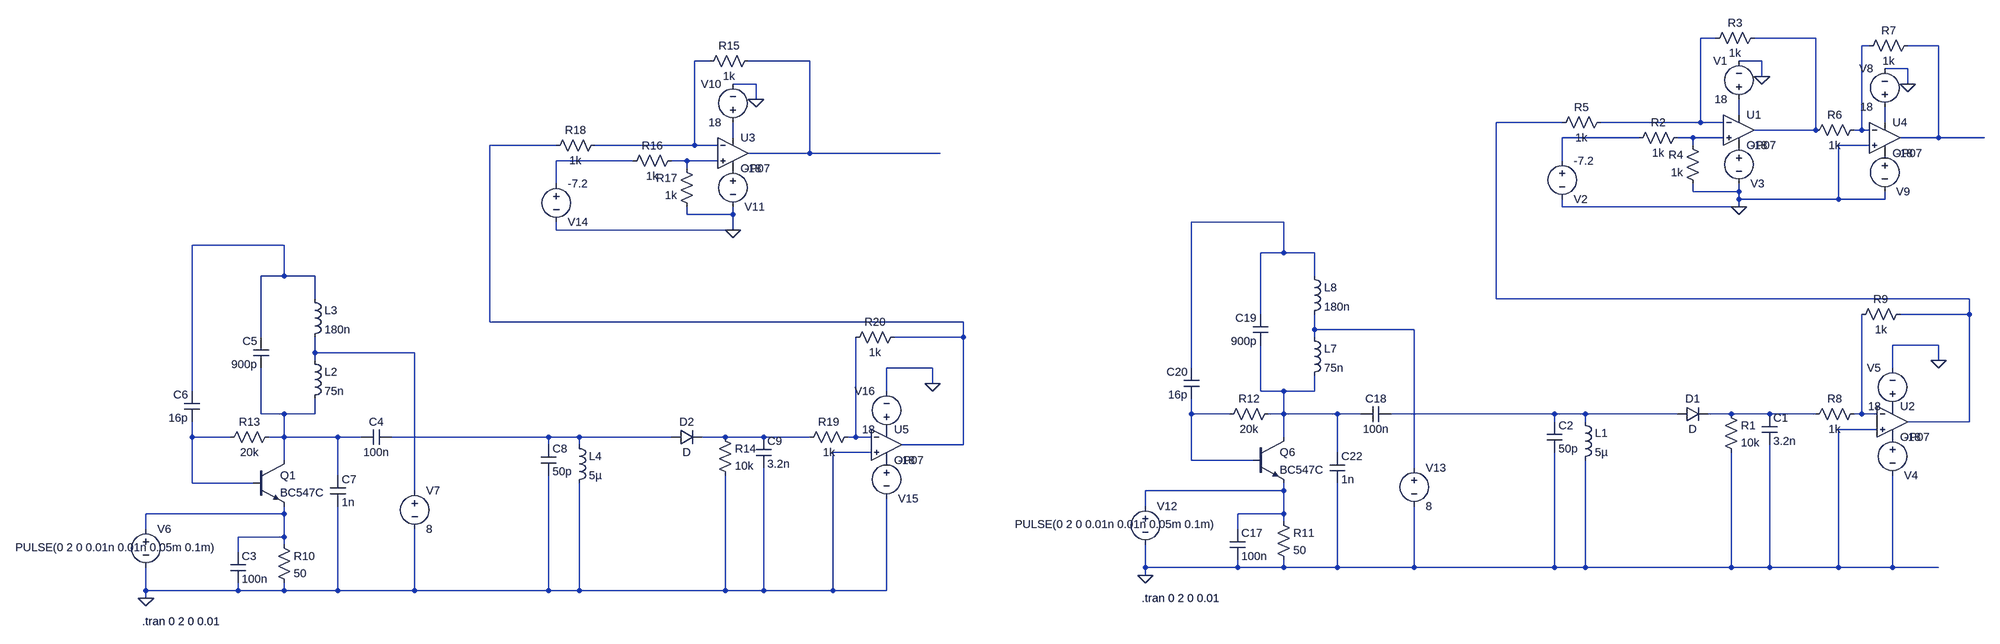
[diagram p0: schematic Empfaenger_Sender_Subtrahierer_Methode01.asc]
Empfaenger_Sender_Subtrahierer_Methode01.asc, the LTspice schematic file:
Version 4
SHEET 1 5860 1152
WIRE 1616 -80 1584 -80
WIRE 1824 -80 1696 -80
WIRE 1936 -64 1920 -64
WIRE 2080 -64 2016 -64
WIRE -1648 -32 -1680 -32
WIRE -1440 -32 -1568 -32
WIRE 1712 -32 1664 -32
WIRE 2016 -16 1968 -16
WIRE 1712 0 1712 -32
WIRE -1552 16 -1600 16
WIRE 2016 16 2016 -16
WIRE -1552 48 -1552 16
WIRE 1664 80 1664 48
WIRE 1296 96 1152 96
WIRE 1584 96 1584 -80
WIRE 1584 96 1376 96
WIRE 1632 96 1584 96
WIRE 1968 96 1968 64
WIRE 1824 112 1824 -80
WIRE 1824 112 1696 112
WIRE 1920 112 1920 -64
WIRE 1920 112 1904 112
WIRE 1936 112 1920 112
WIRE -1600 128 -1600 96
WIRE 1456 128 1296 128
WIRE 1568 128 1536 128
WIRE 1632 128 1568 128
WIRE 2080 128 2080 -64
WIRE 2080 128 2000 128
WIRE 2176 128 2080 128
WIRE -1968 144 -2112 144
WIRE -1680 144 -1680 -32
WIRE -1680 144 -1888 144
WIRE -1632 144 -1680 144
WIRE 1568 144 1568 128
WIRE 1936 144 1872 144
WIRE -1440 160 -1440 -32
WIRE -1440 160 -1568 160
WIRE -1168 160 -1440 160
WIRE -1808 176 -1968 176
WIRE -1696 176 -1728 176
WIRE -1632 176 -1696 176
WIRE 1296 176 1296 128
WIRE -1696 192 -1696 176
WIRE -1968 224 -1968 176
WIRE 1568 240 1568 224
WIRE 1664 240 1664 224
WIRE 1664 240 1568 240
WIRE 1664 256 1664 240
WIRE 1872 256 1872 144
WIRE 1872 256 1664 256
WIRE 1968 256 1968 240
WIRE 1968 256 1872 256
WIRE 1296 272 1296 256
WIRE 1664 272 1664 256
WIRE 1664 272 1296 272
WIRE -1696 288 -1696 272
WIRE -1600 288 -1600 272
WIRE -1600 288 -1696 288
WIRE 544 304 352 304
WIRE -1968 320 -1968 304
WIRE -1600 320 -1600 288
WIRE -1600 320 -1968 320
WIRE -2720 352 -2912 352
WIRE 544 368 544 304
WIRE 544 368 496 368
WIRE 608 368 544 368
WIRE -2720 416 -2720 352
WIRE -2720 416 -2768 416
WIRE -2656 416 -2720 416
WIRE 608 416 608 368
WIRE -2656 464 -2656 416
WIRE 1152 464 1152 96
WIRE 2144 464 1152 464
WIRE 496 496 496 368
WIRE 2144 496 2144 464
WIRE 2144 496 2000 496
WIRE -2112 512 -2112 144
WIRE -1120 512 -2112 512
WIRE 608 528 608 496
WIRE 816 528 608 528
WIRE -2768 544 -2768 416
WIRE -1120 544 -1120 512
WIRE -1120 544 -1264 544
WIRE 608 544 608 528
WIRE 2080 560 1984 560
WIRE -2656 576 -2656 544
WIRE -2448 576 -2656 576
WIRE -2656 592 -2656 576
WIRE 2080 592 2080 560
WIRE -1184 608 -1280 608
WIRE 352 608 352 304
WIRE 1984 608 1984 560
WIRE -1184 640 -1184 608
WIRE -2912 656 -2912 352
WIRE -1280 656 -1280 608
WIRE 496 656 496 560
WIRE 544 656 496 656
WIRE 608 656 608 624
WIRE 608 656 544 656
WIRE -2768 704 -2768 608
WIRE -2720 704 -2768 704
WIRE -2656 704 -2656 672
WIRE -2656 704 -2720 704
WIRE 352 704 352 672
WIRE 432 704 352 704
WIRE 544 704 544 656
WIRE 544 704 512 704
WIRE 656 704 544 704
WIRE 704 704 656 704
WIRE 1280 704 768 704
WIRE 1344 704 1280 704
WIRE 1536 704 1344 704
WIRE 1648 704 1600 704
WIRE 1728 704 1648 704
WIRE 1824 704 1728 704
WIRE 1920 704 1920 496
WIRE 1920 704 1904 704
WIRE 1952 704 1920 704
WIRE 1280 720 1280 704
WIRE 1344 720 1344 704
WIRE 2144 720 2144 496
WIRE 2144 720 2016 720
WIRE 1952 736 1872 736
WIRE -2912 752 -2912 720
WIRE -2832 752 -2912 752
WIRE -2720 752 -2720 704
WIRE -2720 752 -2752 752
WIRE -2608 752 -2720 752
WIRE -2560 752 -2608 752
WIRE -1984 752 -2496 752
WIRE -1920 752 -1984 752
WIRE -1728 752 -1920 752
WIRE -1616 752 -1664 752
WIRE -1536 752 -1616 752
WIRE -1440 752 -1536 752
WIRE -1344 752 -1344 544
WIRE -1344 752 -1360 752
WIRE -1312 752 -1344 752
WIRE 544 752 544 704
WIRE -1984 768 -1984 752
WIRE -1920 768 -1920 752
WIRE -1120 768 -1120 544
WIRE -1120 768 -1248 768
WIRE -1312 784 -1392 784
WIRE 656 784 656 704
WIRE -2720 800 -2720 752
WIRE 352 800 352 704
WIRE 480 800 352 800
WIRE 816 816 816 528
WIRE -2608 832 -2608 752
WIRE -2912 848 -2912 752
WIRE -2784 848 -2912 848
WIRE -2448 864 -2448 576
WIRE 544 864 544 848
WIRE 544 864 256 864
WIRE 256 896 256 864
WIRE -2720 912 -2720 896
WIRE -2720 912 -3008 912
WIRE 544 912 544 864
WIRE 544 912 448 912
WIRE 544 928 544 912
WIRE -3008 944 -3008 912
WIRE 448 944 448 912
WIRE -2720 960 -2720 912
WIRE -2720 960 -2816 960
WIRE -2720 976 -2720 960
WIRE -2816 992 -2816 960
WIRE 256 1024 256 976
WIRE 448 1024 448 1008
WIRE 448 1024 256 1024
WIRE 544 1024 544 1008
WIRE 544 1024 448 1024
WIRE 656 1024 656 848
WIRE 656 1024 544 1024
WIRE 816 1024 816 896
WIRE 816 1024 656 1024
WIRE 1280 1024 1280 784
WIRE 1280 1024 816 1024
WIRE 1344 1024 1344 800
WIRE 1344 1024 1280 1024
WIRE 1648 1024 1648 784
WIRE 1648 1024 1344 1024
WIRE 1728 1024 1728 768
WIRE 1728 1024 1648 1024
WIRE 1872 1024 1872 736
WIRE 1872 1024 1728 1024
WIRE 1984 1024 1984 832
WIRE 1984 1024 1872 1024
WIRE 2080 1024 1984 1024
WIRE 256 1040 256 1024
WIRE -3008 1072 -3008 1024
WIRE -2816 1072 -2816 1056
WIRE -2816 1072 -3008 1072
WIRE -2720 1072 -2720 1056
WIRE -2720 1072 -2816 1072
WIRE -2608 1072 -2608 896
WIRE -2608 1072 -2720 1072
WIRE -2448 1072 -2448 944
WIRE -2448 1072 -2608 1072
WIRE -1984 1072 -1984 832
WIRE -1984 1072 -2448 1072
WIRE -1920 1072 -1920 848
WIRE -1920 1072 -1984 1072
WIRE -1616 1072 -1616 832
WIRE -1616 1072 -1920 1072
WIRE -1536 1072 -1536 816
WIRE -1536 1072 -1616 1072
WIRE -1392 1072 -1392 784
WIRE -1392 1072 -1536 1072
WIRE -1280 1072 -1280 880
WIRE -1280 1072 -1392 1072
WIRE -3008 1088 -3008 1072
FLAG 256 1040 0
FLAG 1712 0 0
FLAG 2080 592 0
FLAG 1664 272 0
FLAG 2016 16 0
FLAG -3008 1088 0
FLAG -1552 48 0
FLAG -1184 640 0
FLAG -1600 320 0
SYMBOL res 528 912 R0
SYMATTR InstName R11
SYMATTR Value 50
SYMBOL cap 432 944 R0
SYMATTR InstName C17
SYMATTR Value 100n
SYMBOL res 528 688 R90
WINDOW 0 0 56 VBottom 2
WINDOW 3 32 56 VTop 2
SYMATTR InstName R12
SYMATTR Value 20k
SYMBOL cap 768 688 R90
WINDOW 0 0 32 VBottom 2
WINDOW 3 32 32 VTop 2
SYMATTR InstName C18
SYMATTR Value 100n
SYMBOL cap 512 560 R180
WINDOW 0 24 56 Left 2
WINDOW 3 24 8 Left 2
SYMATTR InstName C19
SYMATTR Value 900p
SYMBOL cap 368 672 R180
WINDOW 0 24 56 Left 2
WINDOW 3 24 8 Left 2
SYMATTR InstName C20
SYMATTR Value 16p
SYMBOL ind 592 528 R0
SYMATTR InstName L7
SYMATTR Value 75n
SYMBOL ind 592 400 R0
SYMATTR InstName L8
SYMATTR Value 180n
SYMBOL voltage 256 880 R0
WINDOW 123 0 0 Left 0
WINDOW 39 0 0 Left 0
WINDOW 3 -272 54 Left 2
SYMATTR Value PULSE(0 2 0 0.01n 0.01n 0.05m 0.1m)
SYMATTR InstName V12
SYMBOL voltage 816 800 R0
WINDOW 123 0 0 Left 0
WINDOW 39 0 0 Left 0
SYMATTR InstName V13
SYMATTR Value 8
SYMBOL npn 480 752 R0
SYMATTR InstName Q6
SYMATTR Value BC547C
SYMBOL cap 640 784 R0
SYMATTR InstName C22
SYMATTR Value 1n
SYMBOL diode 1536 720 R270
WINDOW 0 32 32 VTop 2
WINDOW 3 0 32 VBottom 2
SYMATTR InstName D1
SYMBOL cap 1264 720 R0
SYMATTR InstName C2
SYMATTR Value 50p
SYMBOL ind 1328 704 R0
SYMATTR InstName L1
SYMATTR Value 5µ
SYMBOL cap 1712 704 R0
SYMATTR InstName C1
SYMATTR Value 3.2n
SYMBOL res 1632 688 R0
SYMATTR InstName R1
SYMATTR Value 10k
SYMBOL voltage 1664 64 R180
WINDOW 0 24 96 Left 2
WINDOW 3 24 16 Left 2
WINDOW 123 0 0 Left 0
WINDOW 39 0 0 Left 0
SYMATTR InstName V1
SYMATTR Value 18
SYMBOL res 1712 -96 R90
WINDOW 0 0 56 VBottom 2
WINDOW 3 32 56 VTop 2
SYMATTR InstName R3
SYMATTR Value 1k
SYMBOL voltage 1664 128 R0
WINDOW 0 24 96 Left 2
WINDOW 3 24 16 Left 2
WINDOW 123 0 0 Left 0
WINDOW 39 0 0 Left 0
SYMATTR InstName V3
SYMATTR Value -18
SYMBOL Opamps\\OP07 1664 48 R0
SYMATTR InstName U1
SYMBOL res 1552 112 R90
WINDOW 0 0 56 VBottom 2
WINDOW 3 32 56 VTop 2
SYMATTR InstName R2
SYMATTR Value 1k
SYMBOL res 1584 240 R180
WINDOW 0 36 76 Left 2
WINDOW 3 36 40 Left 2
SYMATTR InstName R4
SYMATTR Value 1k
SYMBOL res 1280 112 R270
WINDOW 0 32 56 VTop 2
WINDOW 3 0 56 VBottom 2
SYMATTR InstName R5
SYMATTR Value 1k
SYMBOL voltage 1296 160 R0
WINDOW 0 24 96 Left 2
WINDOW 3 24 16 Left 2
WINDOW 123 0 0 Left 0
WINDOW 39 0 0 Left 0
SYMATTR InstName V2
SYMATTR Value -7.2
SYMBOL Opamps\\OP07 1984 656 R0
SYMATTR InstName U2
SYMBOL voltage 1984 736 R0
WINDOW 0 24 96 Left 2
WINDOW 3 24 16 Left 2
WINDOW 123 0 0 Left 0
WINDOW 39 0 0 Left 0
SYMATTR InstName V4
SYMATTR Value -18
SYMBOL voltage 1984 704 R180
WINDOW 0 24 96 Left 2
WINDOW 3 24 16 Left 2
WINDOW 123 0 0 Left 0
WINDOW 39 0 0 Left 0
SYMATTR InstName V5
SYMATTR Value 18
SYMBOL res 1920 688 R90
WINDOW 0 0 56 VBottom 2
WINDOW 3 32 56 VTop 2
SYMATTR InstName R8
SYMATTR Value 1k
SYMBOL res 2016 480 R90
WINDOW 0 0 56 VBottom 2
WINDOW 3 32 56 VTop 2
SYMATTR InstName R9
SYMATTR Value 1k
SYMBOL Opamps\\OP07 1968 64 R0
SYMATTR InstName U4
SYMBOL voltage 1968 80 R180
WINDOW 0 24 96 Left 2
WINDOW 3 24 16 Left 2
WINDOW 123 0 0 Left 0
WINDOW 39 0 0 Left 0
SYMATTR InstName V8
SYMATTR Value 18
SYMBOL voltage 1968 144 R0
WINDOW 0 24 96 Left 2
WINDOW 3 24 16 Left 2
WINDOW 123 0 0 Left 0
WINDOW 39 0 0 Left 0
SYMATTR InstName V9
SYMATTR Value -18
SYMBOL res 1920 96 R90
WINDOW 0 0 56 VBottom 2
WINDOW 3 32 56 VTop 2
SYMATTR InstName R6
SYMATTR Value 1k
SYMBOL res 2032 -80 R90
WINDOW 0 0 56 VBottom 2
WINDOW 3 32 56 VTop 2
SYMATTR InstName R7
SYMATTR Value 1k
SYMBOL res -2736 960 R0
SYMATTR InstName R10
SYMATTR Value 50
SYMBOL cap -2832 992 R0
SYMATTR InstName C3
SYMATTR Value 100n
SYMBOL res -2736 736 R90
WINDOW 0 0 56 VBottom 2
WINDOW 3 32 56 VTop 2
SYMATTR InstName R13
SYMATTR Value 20k
SYMBOL cap -2496 736 R90
WINDOW 0 0 32 VBottom 2
WINDOW 3 32 32 VTop 2
SYMATTR InstName C4
SYMATTR Value 100n
SYMBOL cap -2752 608 R180
WINDOW 0 24 56 Left 2
WINDOW 3 24 8 Left 2
SYMATTR InstName C5
SYMATTR Value 900p
SYMBOL cap -2896 720 R180
WINDOW 0 24 56 Left 2
WINDOW 3 24 8 Left 2
SYMATTR InstName C6
SYMATTR Value 16p
SYMBOL ind -2672 576 R0
SYMATTR InstName L2
SYMATTR Value 75n
SYMBOL ind -2672 448 R0
SYMATTR InstName L3
SYMATTR Value 180n
SYMBOL voltage -3008 928 R0
WINDOW 123 0 0 Left 0
WINDOW 39 0 0 Left 0
WINDOW 3 -272 54 Left 2
SYMATTR Value PULSE(0 2 0 0.01n 0.01n 0.05m 0.1m)
SYMATTR InstName V6
SYMBOL voltage -2448 848 R0
WINDOW 123 0 0 Left 0
WINDOW 39 0 0 Left 0
SYMATTR InstName V7
SYMATTR Value 8
SYMBOL npn -2784 800 R0
SYMATTR InstName Q1
SYMATTR Value BC547C
SYMBOL cap -2624 832 R0
SYMATTR InstName C7
SYMATTR Value 1n
SYMBOL diode -1728 768 R270
WINDOW 0 32 32 VTop 2
WINDOW 3 0 32 VBottom 2
SYMATTR InstName D2
SYMBOL cap -2000 768 R0
SYMATTR InstName C8
SYMATTR Value 50p
SYMBOL ind -1936 752 R0
SYMATTR InstName L4
SYMATTR Value 5µ
SYMBOL cap -1552 752 R0
SYMATTR InstName C9
SYMATTR Value 3.2n
SYMBOL res -1632 736 R0
SYMATTR InstName R14
SYMATTR Value 10k
SYMBOL voltage -1600 112 R180
WINDOW 0 24 96 Left 2
WINDOW 3 24 16 Left 2
WINDOW 123 0 0 Left 0
WINDOW 39 0 0 Left 0
SYMATTR InstName V10
SYMATTR Value 18
SYMBOL res -1552 -48 R90
WINDOW 0 0 56 VBottom 2
WINDOW 3 32 56 VTop 2
SYMATTR InstName R15
SYMATTR Value 1k
SYMBOL voltage -1600 176 R0
WINDOW 0 24 96 Left 2
WINDOW 3 24 16 Left 2
WINDOW 123 0 0 Left 0
WINDOW 39 0 0 Left 0
SYMATTR InstName V11
SYMATTR Value -18
SYMBOL Opamps\\OP07 -1600 96 R0
SYMATTR InstName U3
SYMBOL res -1712 160 R90
WINDOW 0 0 56 VBottom 2
WINDOW 3 32 56 VTop 2
SYMATTR InstName R16
SYMATTR Value 1k
SYMBOL res -1680 288 R180
WINDOW 0 36 76 Left 2
WINDOW 3 36 40 Left 2
SYMATTR InstName R17
SYMATTR Value 1k
SYMBOL res -1984 160 R270
WINDOW 0 32 56 VTop 2
WINDOW 3 0 56 VBottom 2
SYMATTR InstName R18
SYMATTR Value 1k
SYMBOL voltage -1968 208 R0
WINDOW 0 24 96 Left 2
WINDOW 3 24 16 Left 2
WINDOW 123 0 0 Left 0
WINDOW 39 0 0 Left 0
SYMATTR InstName V14
SYMATTR Value -7.2
SYMBOL Opamps\\OP07 -1280 704 R0
SYMATTR InstName U5
SYMBOL voltage -1280 784 R0
WINDOW 0 24 96 Left 2
WINDOW 3 24 16 Left 2
WINDOW 123 0 0 Left 0
WINDOW 39 0 0 Left 0
SYMATTR InstName V15
SYMATTR Value -18
SYMBOL voltage -1280 752 R180
WINDOW 0 24 96 Left 2
WINDOW 3 24 16 Left 2
WINDOW 123 0 0 Left 0
WINDOW 39 0 0 Left 0
SYMATTR InstName V16
SYMATTR Value 18
SYMBOL res -1344 736 R90
WINDOW 0 0 56 VBottom 2
WINDOW 3 32 56 VTop 2
SYMATTR InstName R19
SYMATTR Value 1k
SYMBOL res -1248 528 R90
WINDOW 0 0 56 VBottom 2
WINDOW 3 32 56 VTop 2
SYMATTR InstName R20
SYMATTR Value 1k
TEXT 248 1088 Left 2 !.tran 0 2 0 0.01
TEXT -3016 1136 Left 2 !.tran 0 2 0 0.01

The netlist it stands for:
* Empfaenger_Sender_Subtrahierer_Methode01.asc
R11 N030 0 50
C17 N030 0 100n
R12 N020 N022 20k
C18 N023 N020 100n
C19 N020 N016 900p
C20 N022 N016 16p
L7 N018 N020 75n
L8 N016 N018 180n
V12 N030 0 PULSE(0 2 0 0.01n 0.01n 0.05m 0.1m)
V13 N018 0 8
Q6 N020 N022 N030 0 BC547C
C22 N020 0 1n
D1 N023 N024 D
C2 N023 0 50p
L1 N023 0 5µ
C1 N024 0 3.2n
R1 N024 0 10k
V1 N007 0 18
R3 N002 N001 1k
V3 P001 0 -18
XU1 N012 N001 N007 P001 N002 LT1001  ; OP07, pins In+ In- V+ V- OUT
R2 N012 N011 1k
R4 0 N012 1k
R5 N008 N001 1k
V2 N011 0 -7.2
XU2 0 N025 P002 P003 N008 LT1001  ; OP07, pins In+ In- V+ V- OUT
V4 P003 0 -18
V5 P002 0 18
R8 N025 N024 1k
R9 N008 N025 1k
XU4 0 N003 N009 P004 N004 LT1001  ; OP07, pins In+ In- V+ V- OUT
V8 N009 0 18
V9 P004 0 -18
R6 N003 N002 1k
R7 N004 N003 1k
R10 N031 0 50
C3 N031 0 100n
R13 N021 N026 20k
C4 N027 N021 100n
C5 N021 N017 900p
C6 N026 N017 16p
L2 N019 N021 75n
L3 N017 N019 180n
V6 N031 0 PULSE(0 2 0 0.01n 0.01n 0.05m 0.1m)
V7 N019 0 8
Q1 N021 N026 N031 0 BC547C
C7 N021 0 1n
D2 N027 N028 D
C8 N027 0 50p
L4 N027 0 5µ
C9 N028 0 3.2n
R14 N028 0 10k
V10 N010 0 18
R15 N006 N005 1k
V11 P005 0 -18
XU3 N015 N005 N010 P005 N006 LT1001  ; OP07, pins In+ In- V+ V- OUT
R16 N015 N014 1k
R17 0 N015 1k
R18 N013 N005 1k
V14 N014 0 -7.2
XU5 0 N029 P006 P007 N013 LT1001  ; OP07, pins In+ In- V+ V- OUT
V15 P007 0 -18
V16 P006 0 18
R19 N029 N028 1k
R20 N013 N029 1k
.model D D
.lib standard.dio
.model NPN NPN
.model PNP PNP
.lib standard.bjt
.tran 0 2 0 0.01
.tran 0 2 0 0.01
.lib LTC.lib
.backanno
.end